# Altium project capstone_pcb.PrjPcb (part 1 of 2)
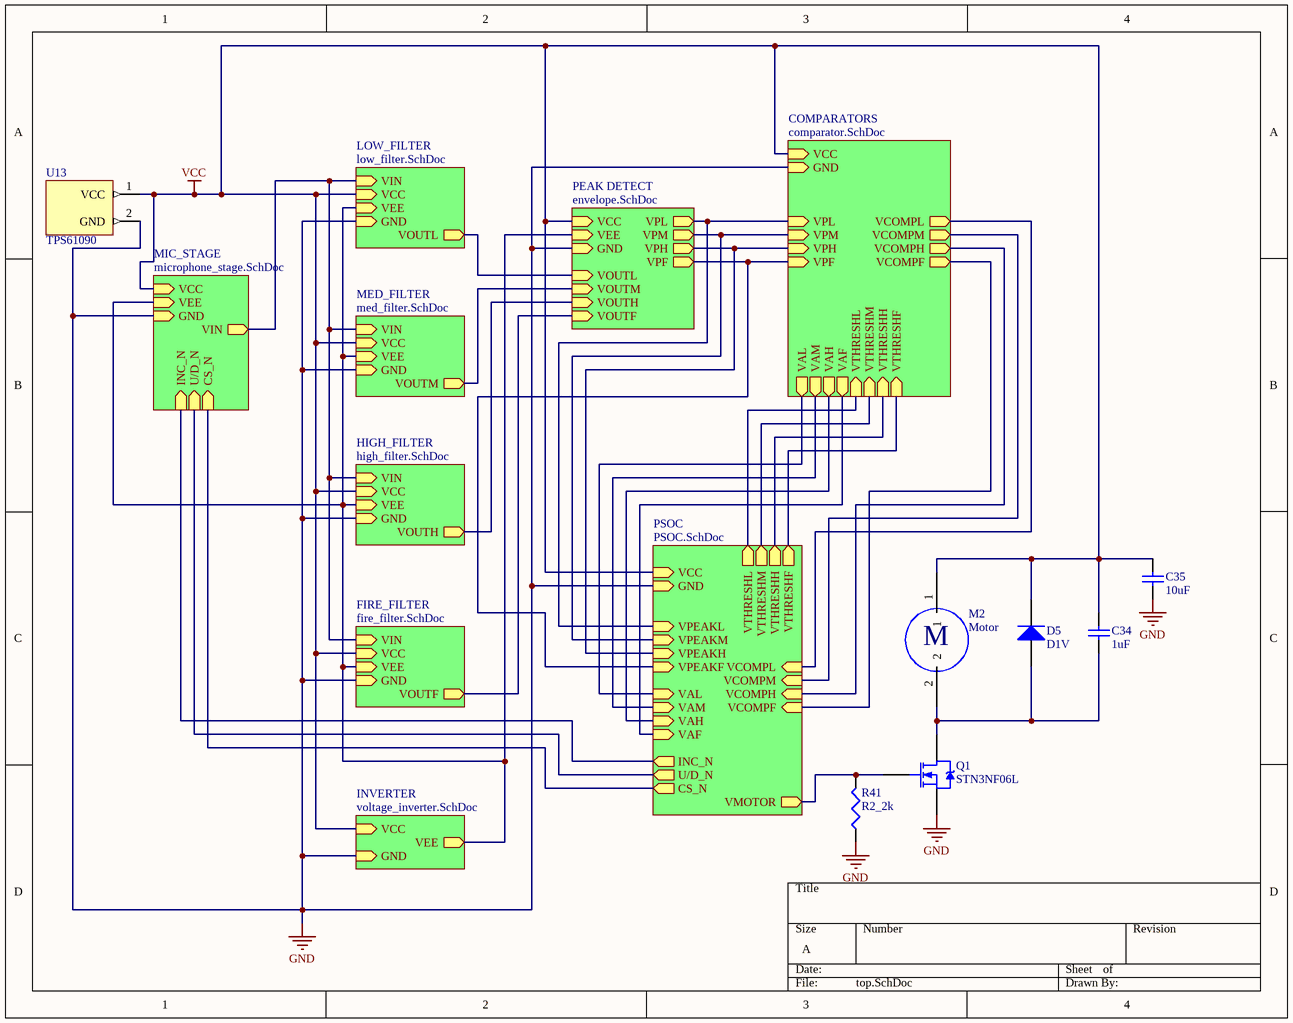
[diagram p0: top.SchDoc]
10 sheets, 108 parts. Net scope: hierarchical (ports join the sheet entries above them; power ports are global).
Board file: top_pcb.PcbDoc
Sheets:
  top.SchDoc
    LOW_FILTER = low_filter.SchDoc
    MED_FILTER = med_filter.SchDoc
    HIGH_FILTER = high_filter.SchDoc
    FIRE_FILTER = fire_filter.SchDoc
    INVERTER = voltage_inverter.SchDoc
    COMPARATORS = comparator.SchDoc
    MIC_STAGE = microphone_stage.SchDoc
    PEAK DETECT = envelope.SchDoc
    PSOC = PSOC.SchDoc

## Sheet top.SchDoc
size A

### Parts
C34  1uF  [C0603]
C35  10uF  [C0603]
D5  D1V  [D1206]
M2  Motor  [B2B-PH-K-S]
Q1  STN3NF06L  [SOT-223]
R41  R2_2k  [R0603]
U13  TPS61090  [B2B-PH-K-S]

### Sub-sheets
COMPARATORS = comparator.SchDoc: VCC (in), VTHRESHL (in), VTHRESHM (in), VTHRESHH (in), GND (in), VTHRESHF (in), VAL (out), VAM (out), VAH (out), VAF (out), VPL (in), VPM (in), VPH (in), VPF (in), VCOMPL (out), VCOMPM (out), VCOMPH (out), VCOMPF (out)
FIRE_FILTER = fire_filter.SchDoc: GND (in), VEE (in), VIN (in), VCC (in), VOUTF (out)
HIGH_FILTER = high_filter.SchDoc: GND (in), VEE (in), VIN (in), VCC (in), VOUTH (out)
INVERTER = voltage_inverter.SchDoc: VCC (in), VEE (out), GND (in)
LOW_FILTER = low_filter.SchDoc: VIN (in), VCC (in), VOUTL (out), VEE (in), GND (in)
MED_FILTER = med_filter.SchDoc: GND (in), VCC (in), VEE (in), VIN (in), VOUTM (out)
MIC_STAGE = microphone_stage.SchDoc: VIN (out), VCC (in), GND (in), VEE (in), U/D_N (in), INC_N (in), CS_N (in)
PEAK DETECT = envelope.SchDoc: VCC (in), VPL (out), VPH (out), VPM (out), VPF (out), GND (in), VEE (in), VOUTL (in), VOUTM (in), VOUTF (in), VOUTH (in)
PSOC = PSOC.SchDoc: VCC (in), VTHRESHL (out), VTHRESHM (out), VTHRESHH (out), VTHRESHF (out), VAL (in), VAM (in), VAH (in), VAF (in), VMOTOR (out), GND (in), VCOMPL (in), VCOMPM (in), VCOMPH (in), VCOMPF (in), INC_N (out), U/D_N (out), CS_N (out), VPEAKL (in), VPEAKM (in), VPEAKH (in), VPEAKF (in)

### Nets
GND: C35.1 Q1.3(S) R41.1 U13.2(GND) ; sheet LOW_FILTER/GND, sheet MED_FILTER/GND, sheet HIGH_FILTER/GND, sheet FIRE_FILTER/GND, sheet INVERTER/GND, sheet COMPARATORS/GND, sheet MIC_STAGE/GND, sheet PEAK DETECT/GND, sheet PSOC/GND
VCC: C34.2 C35.2 D5.2(K) M2.1 U13.1(VCC) ; sheet LOW_FILTER/VCC, sheet MED_FILTER/VCC, sheet HIGH_FILTER/VCC, sheet FIRE_FILTER/VCC, sheet INVERTER/VCC, sheet COMPARATORS/VCC, sheet MIC_STAGE/VCC, sheet PEAK DETECT/VCC, sheet PSOC/VCC
NetC3_1: sheet LOW_FILTER/VOUTL, sheet PEAK DETECT/VOUTL
NetC7_1: sheet MED_FILTER/VOUTM, sheet PEAK DETECT/VOUTM
NetC11_1: sheet HIGH_FILTER/VOUTH, sheet PEAK DETECT/VOUTH
NetC15_1: sheet FIRE_FILTER/VOUTF, sheet PEAK DETECT/VOUTF
NetC18_1: sheet LOW_FILTER/VEE, sheet MED_FILTER/VEE, sheet HIGH_FILTER/VEE, sheet FIRE_FILTER/VEE, sheet INVERTER/VEE, sheet MIC_STAGE/VEE, sheet PEAK DETECT/VEE
NetC19_1: sheet COMPARATORS/VAL, sheet PSOC/VAL
NetC20_2: sheet COMPARATORS/VCOMPL, sheet PSOC/VCOMPL
NetC21_1: sheet COMPARATORS/VAM, sheet PSOC/VAM
NetC22_2: sheet COMPARATORS/VCOMPM, sheet PSOC/VCOMPM
NetC23_1: sheet COMPARATORS/VAH, sheet PSOC/VAH
NetC24_2: sheet COMPARATORS/VCOMPH, sheet PSOC/VCOMPH
NetC26_2: sheet COMPARATORS/VCOMPF, sheet PSOC/VCOMPF
NetC27_1: sheet COMPARATORS/VPL, sheet PEAK DETECT/VPL, sheet PSOC/VPEAKL
NetC28_1: sheet COMPARATORS/VPM, sheet PEAK DETECT/VPM, sheet PSOC/VPEAKM
NetC29_1: sheet COMPARATORS/VPH, sheet PEAK DETECT/VPH, sheet PSOC/VPEAKH
NetC30_1: sheet COMPARATORS/VPF, sheet PEAK DETECT/VPF, sheet PSOC/VPEAKF
NetC34_1: C34.1 D5.1(A) M2.2 Q1.2(D)
NetQ1_1: Q1.1(G) R41.2 ; sheet PSOC/VMOTOR
NetR1_1: sheet LOW_FILTER/VIN, sheet MED_FILTER/VIN, sheet HIGH_FILTER/VIN, sheet FIRE_FILTER/VIN, sheet MIC_STAGE/VIN
NetR25_2: sheet COMPARATORS/VTHRESHL, sheet PSOC/VTHRESHL
NetR27_2: sheet COMPARATORS/VTHRESHM, sheet PSOC/VTHRESHM
NetR29_2: sheet COMPARATORS/VTHRESHH, sheet PSOC/VTHRESHH
NetR31_2: sheet COMPARATORS/VTHRESHF, sheet COMPARATORS/VAF, sheet PSOC/VTHRESHF, sheet PSOC/VAF
NetR43_1: sheet MIC_STAGE/INC_N, sheet PSOC/INC_N
NetR43_2: sheet MIC_STAGE/U/D_N, sheet PSOC/U/D_N
NetR43_7: sheet MIC_STAGE/CS_N, sheet PSOC/CS_N

### Notes on the sheet
- (in symbol Motor) M

### Library data of the parts
C34 = C1uF: 1 uF Surface Mount Capacitor; Manufacturer: Murata Electronics North America; Manufacturer Part Number: GRM188R61C105KA93D; Capacitance: 1µF; Tolerance: ±10%; Voltage - Rated: 16V; Temperature Coefficient: X5R; Supplier 1: Digi-Key; RoHS: RoHS Compliant; Category: Capacitors; Stock 1: 1349645; Pricing 1: 1=0.1, 10=0.034, 50=0.0182, 100=0.0154, 250=0.0126, 500=0.01078, 1000=0.0084 (USD); Packaging: Digi-Reel®; Part Status: Active; Operating Temperature: -55°C ~ 85°C; Features: -; Ratings: -; Applications: General Purpose; Mounting Type: Surface Mount, MLCC; Package / Case: 0603 (1608 Metric); Size / Dimension: 0.063" L x 0.031" W (1.60mm x 0.80mm); Height - Seated (Max): -; Thickness (Max): 0.035" (0.90mm); Lead Spacing: -; Lead Style: -; ComponentLink1URL: http://www.murata.com/~/media/webrenewal/support/library/catalog/products/capacitor/mlcc/c02e.pdf; ComponentLink1Description: http://www.murata.com/~/media/webrenewal/support/library/catalog/products/capacitor/mlcc/c02e.pdf; Supplier Part Number 1: 490-1536-6-ND
C35 = C10uF: 10 uF Surface Mount Capacitor; Manufacturer: Yageo; Manufacturer Part Number: CC0603KRX5R5BB106; Capacitance: 10µF; Tolerance: ±10%; Voltage - Rated: 6.3V; Temperature Coefficient: X5R; Supplier 1: Digi-Key; RoHS: RoHS Compliant; Category: Capacitors; Stock 1: 18386; Pricing 1: 1=0.27, 10=0.186, 25=0.1488, 50=0.124, 100=0.1054, 250=0.08368, 500=0.0744, 1000=0.06509 (USD); Packaging: Digi-Reel®; Part Status: Active; Operating Temperature: -55°C ~ 85°C; Features: -; Ratings: -; Applications: General Purpose; Failure Rate: -; Mounting Type: Surface Mount, MLCC; Package / Case: 0603 (1608 Metric); Size / Dimension: 0.063" L x 0.031" W (1.60mm x 0.80mm); Height - Seated (Max): -; Thickness (Max): 0.035" (0.90mm); Lead Spacing: -; Lead Style: -; ComponentLink1URL: http://www.yageo.com/documents/recent/UPY-GPHC_X5R_4V-to-50V_23.pdf; ComponentLink1Description: http://www.yageo.com/documents/recent/UPY-GPHC_X5R_4V-to-50V_23.pdf; Supplier Part Number 1: 311-1781-6-ND
D5 = D1V: Standard 1V Diode; Manufacturer: Bourns Inc.; Manufacturer Part Number: CD1206-S01575; Voltage - DC Reverse (Vr) (Max): 100V; Current - Average Rectified (Io): 150mA; Voltage - Forward (Vf) (Max) @ If: 1V @ 50mA; Speed: Small Signal =< 200mA (Io), Any Speed; Reverse Recovery Time (trr): 4ns; Current - Reverse Leakage @ Vr: 2.5µA @ 100V; Capacitance @ Vr, F: 3pF @ 0V, 100MHz; Supplier 1: Digi-Key; RoHS: RoHS Compliant; Category: Discrete Semiconductor Products; Stock 1: 122779; Pricing 1: 1=0.15, 10=0.142, 25=0.1288, 100=0.0927, 250=0.0546, 500=0.04532, 1000=0.0309, 2500=0.02626 (USD); Packaging: Cut Tape (CT); Part Status: Active; Diode Type: Standard; Mounting Type: Surface Mount; Package / Case: 1206 (3216 Metric); Supplier Device Package: 1206; Operating Temperature - Junction: -55°C ~ 125°C; ComponentLink1URL: http://www.bourns.com/docs/Product-Datasheets/CD1206_S01575.pdf; ComponentLink1Description: http://www.bourns.com/docs/Product-Datasheets/CD1206_S01575.pdf; Supplier Part Number 1: CD1206-S01575CT-ND
M2 = Motor: Manufacturer: JST Sales America Inc.; Manufacturer Part Number: B2B-PH-K-S(LF)(SN); Connector Type: Header, Shrouded; Number of Positions: 2; Number of Positions Loaded: All; Pitch: 0.079" (2.00mm); Supplier 1: Digi-Key; RoHS: RoHS Compliant; Category: Connectors, Interconnects; Stock 1: 349866; Pricing 1: 1=0.17, 10=0.162, 100=0.1002, 500=0.08288, 1000=0.07252, 5000=0.06216, 10000=0.06044 (USD); Packaging: Bulk; Part Status: Active; Contact Type: Male Pin; Number of Rows: 1; Row Spacing: -; Contact Mating Length: 0.130" (3.30mm); Mounting Type: Through Hole; Termination: Press-Fit, Solder; Fastening Type: Detent Lock; Features: -; Contact Finish: Tin; Contact Finish Thickness: -; Color: Natural; ComponentLink1URL: http://www.jst-mfg.com/product/pdf/eng/ePH.pdf; ComponentLink1Description: http://www.jst-mfg.com/product/pdf/eng/ePH.pdf; Supplier Part Number 1: 455-1704-ND
Q1 = STN3NF06L: N-Channel 4A Power MOSFET; Manufacturer: STMicroelectronics; Drain to Source Voltage (Vdss): 60V; Current - Continuous Drain (Id) @ 25°C: 4A (Tc); Drive Voltage (Max Rds On,  Min Rds On): 5V, 10V; Vgs(th) (Max) @ Id: 2.8V @ 250µA; Gate Charge (Qg) (Max) @ Vgs: 9nC @ 5V; Input Capacitance (Ciss) (Max) @ Vds: 340pF @ 25V; Vgs (Max): ±16V; Power Dissipation (Max): 3.3W (Tc); Rds On (Max) @ Id, Vgs: 100 mOhm @ 1.5A, 10V; Supplier 1: Digi-Key; Manufacturer Part Number: STN3NF06L; RoHS: RoHS Compliant; Category: Discrete Semiconductor Products; Stock 1: 8902; Pricing 1: 1=0.63, 10=0.541, 100=0.4038, 500=0.31724, 1000=0.24514 (USD); Packaging: Digi-Reel®; Part Status: Active; FET Type: N-Channel; Technology: MOSFET (Metal Oxide); FET Feature: -; Operating Temperature: -55°C ~ 150°C (TJ); Mounting Type: Surface Mount; Supplier Device Package: SOT-223; Package / Case: TO-261-4, TO-261AA; ComponentLink1URL: http://www.st.com/content/ccc/resource/technical/document/datasheet/b1/52/93/f0/a9/a9/40/d7/CD00002430.pdf/files/CD00002430.pdf/jcr:content/translations/en.CD00002430.pdf; ComponentLink1Description: http://www.st.com/content/ccc/resource/technical/document/datasheet/b1/52/93/f0/a9/a9/40/d7/CD00002430.pdf/files/CD00002430.pdf/jcr:content/translations/en.CD00002430.pdf; Supplier Part Number 1: 497-3177-6-ND
R41 = R2_2k: 2.2k Ohms Surface Mount Resistor; Manufacturer: Yageo; Manufacturer Part Number: RC0603FR-072K2L; Tolerance: ±1%; Power (Watts): 0.1W, 1/10W; Temperature Coefficient: ±100ppm/°C; Supplier 1: Digi-Key; RoHS: RoHS Compliant; Category: Resistors; Stock 1: 4524664; Pricing 1: 1=0.1, 10=0.013, 25=0.0092, 50=0.007, 100=0.0052, 250=0.00396, 500=0.00316, 1000=0.00233 (USD); Packaging: Digi-Reel®; Part Status: Active; Resistance (Ohms): 2.2k; Composition: Thick Film; Features: Moisture Resistant; Operating Temperature: -55°C ~ 155°C; Package / Case: 0603 (1608 Metric); Supplier Device Package: 0603; Size / Dimension: 0.063" L x 0.031" W (1.60mm x 0.80mm); Height - Seated (Max): 0.022" (0.55mm); Number of Terminations: 2; Failure Rate: -; ComponentLink1URL: http://www.yageo.com/NewPortal/yageodocoutput?fileName=/pdf/R-Chip/PYu-RC_Group_51_RoHS_L_4.pdf; ComponentLink1Description: http://www.yageo.com/NewPortal/yageodocoutput?fileName=/pdf/R-Chip/PYu-RC_Group_51_RoHS_L_4.pdf; Supplier Part Number 1: 311-2.20KHRDKR-ND
U13 = TPS61090: Power Electronics Connector; Manufacturer: JST Sales America Inc.; Manufacturer Part Number: B2B-PH-K-S(LF)(SN); Connector Type: Header; Pitch - Mating: 0.079" (2.00mm); Shrouding: Shrouded - 4 Wall; Number of Positions: 2; Number of Positions Loaded: All; Contact Length - Mating: 0.130" (3.30mm); Supplier 1: Digi-Key; RoHS: RoHS Compliant; Category: Connectors, Interconnects; Stock 1: 327416; Pricing 1: 1=0.17, 10=0.162, 100=0.1002, 500=0.08288, 1000=0.07252, 5000=0.06216, 10000=0.06044 (USD); Packaging: Bulk; Part Status: Active; Contact Type: Male Pin; Number of Rows: 1; Row Spacing - Mating: -; Mounting Type: Through Hole; Termination: Press-Fit, Solder; Fastening Type: Detent Lock; Features: -; Contact Finish - Mating: Tin; Contact Finish Thickness - Mating: -; Insulation Color: Natural; Ingress Protection: -; ComponentLink1URL: http://www.jst-mfg.com/product/pdf/eng/ePH.pdf; ComponentLink1Description: http://www.jst-mfg.com/product/pdf/eng/ePH.pdf; Supplier Part Number 1: 455-1704-ND

## Sheet low_filter.SchDoc
size A
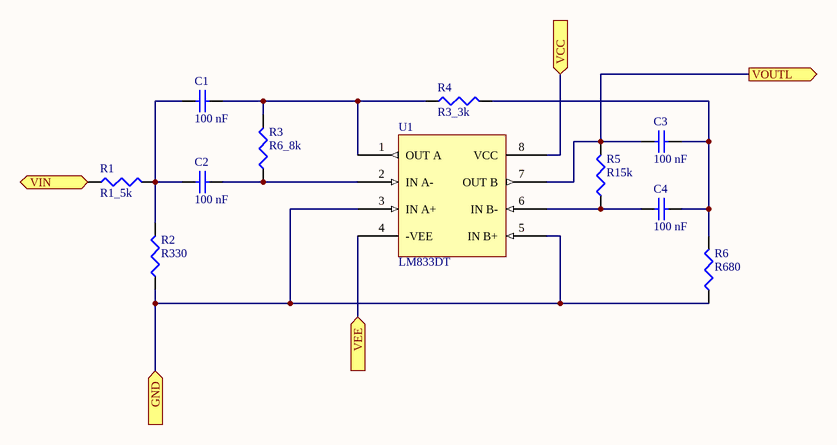
[diagram p1: low_filter.SchDoc]

### Parts
C1  100 nF  [C0603]
C2  100 nF  [C0603]
C3  100 nF  [C0603]
C4  100 nF  [C0603]
R1  R1_5k  [R0603]
R2  R330  [R0603]
R3  R6_8k  [R0603]
R4  R3_3k  [R0603]
R5  R15k  [R0603]
R6  R680  [R0603]
U1  LM833DT  [soic8]

### Ports
GND (in), VCC (in), VEE (in), VIN (in), VOUTL (out)

### Nets
GND: R2.1 R6.1 U1.3(IN_A+) U1.5(IN_B+) ; port GND
VCC: U1.8(VCC) ; port VCC
NetC1_1: C1.1 C2.1 R1.2 R2.2
NetC1_2: C1.2 R3.2 R4.1 U1.1(OUT_A)
NetC2_2: C2.2 R3.1 U1.2(IN_A-)
NetC3_1: C3.1 R5.2 U1.7(OUT_B) ; port VOUTL
NetC3_2: C3.2 C4.2 R4.2 R6.2
NetC4_1: C4.1 R5.1 U1.6(IN_B-)
NetC18_1: U1.4(-VEE) ; port VEE
NetR1_1: R1.1 ; port VIN

### Library data of the parts
C1-C4 = C100nF: 100 nF Surface Mount Capacitor; Manufacturer: Murata Electronics North America; Manufacturer Part Number: GRM188R71C104KA01D; Capacitance: 0.10µF; Tolerance: ±10%; Voltage - Rated: 16V; Temperature Coefficient: X7R; Supplier 1: Digi-Key; RoHS: RoHS Compliant; Category: Capacitors; Stock 1: 4165009; Pricing 1: 1=0.1, 10=0.019, 50=0.0102, 100=0.0086, 250=0.00704, 500=0.006, 1000=0.00468 (USD); Packaging: Digi-Reel®; Part Status: Active; Operating Temperature: -55°C ~ 125°C; Features: -; Ratings: -; Applications: General Purpose; Mounting Type: Surface Mount, MLCC; Package / Case: 0603 (1608 Metric); Size / Dimension: 0.063" L x 0.031" W (1.60mm x 0.80mm); Height - Seated (Max): -; Thickness (Max): 0.035" (0.90mm); Lead Spacing: -; Lead Style: -; ComponentLink1URL: http://www.murata.com/~/media/webrenewal/support/library/catalog/products/capacitor/mlcc/c02e.pdf; ComponentLink1Description: http://www.murata.com/~/media/webrenewal/support/library/catalog/products/capacitor/mlcc/c02e.pdf; Supplier Part Number 1: 490-1532-6-ND
R1 = R1_5k: 1.5k Ohms Surface Mount Resistor; Manufacturer: Yageo; Manufacturer Part Number: RC0603FR-071K5L; Tolerance: ±1%; Power (Watts): 0.1W, 1/10W; Temperature Coefficient: ±100ppm/°C; Supplier 1: Digi-Key; RoHS: RoHS Compliant; Category: Resistors; Stock 1: 1526580; Pricing 1: 1=0.1, 10=0.013, 25=0.0092, 50=0.007, 100=0.0052, 250=0.00396, 500=0.00316, 1000=0.00233 (USD); Packaging: Digi-Reel®; Part Status: Active; Resistance (Ohms): 1.5k; Composition: Thick Film; Features: Moisture Resistant; Operating Temperature: -55°C ~ 155°C; Package / Case: 0603 (1608 Metric); Supplier Device Package: 0603; Size / Dimension: 0.063" L x 0.031" W (1.60mm x 0.80mm); Height - Seated (Max): 0.022" (0.55mm); Number of Terminations: 2; Failure Rate: -; ComponentLink1URL: http://www.yageo.com/NewPortal/yageodocoutput?fileName=/pdf/R-Chip/PYu-RC_Group_51_RoHS_L_4.pdf; ComponentLink1Description: http://www.yageo.com/NewPortal/yageodocoutput?fileName=/pdf/R-Chip/PYu-RC_Group_51_RoHS_L_4.pdf; Supplier Part Number 1: 311-1.50KHRDKR-ND
R2 = R330: 330 Ohms Surface Mount Resistor; Manufacturer: Yageo; Manufacturer Part Number: RC0603FR-07330RL; Resistance (Ohms): 330; Tolerance: ±1%; Power (Watts): 0.1W, 1/10W; Temperature Coefficient: ±100ppm/°C; Supplier 1: Digi-Key; RoHS: RoHS Compliant; Category: Resistors; Stock 1: 2252499; Pricing 1: 1=0.1, 10=0.013, 25=0.0092, 50=0.007, 100=0.0052, 250=0.00396, 500=0.00316, 1000=0.00233 (USD); Packaging: Digi-Reel®; Part Status: Active; Composition: Thick Film; Features: Moisture Resistant; Operating Temperature: -55°C ~ 155°C; Package / Case: 0603 (1608 Metric); Supplier Device Package: 0603; Size / Dimension: 0.063" L x 0.031" W (1.60mm x 0.80mm); Height - Seated (Max): 0.022" (0.55mm); Number of Terminations: 2; Failure Rate: -; ComponentLink1URL: http://www.yageo.com/NewPortal/yageodocoutput?fileName=/pdf/R-Chip/PYu-RC_Group_51_RoHS_L_4.pdf; ComponentLink1Description: http://www.yageo.com/NewPortal/yageodocoutput?fileName=/pdf/R-Chip/PYu-RC_Group_51_RoHS_L_4.pdf; Supplier Part Number 1: 311-330HRDKR-ND
R3 = R6_8k: 6.8k Ohms Surface Mount Resistor; Manufacturer: Panasonic Electronic Components; Manufacturer Part Number: ERJ-3EKF6801V; Tolerance: ±1%; Power (Watts): 0.1W, 1/10W; Temperature Coefficient: ±100ppm/°C; Supplier 1: Digi-Key; RoHS: RoHS Compliant; Category: Resistors; Stock 1: 100612; Pricing 1: 1=0.1, 10=0.019, 25=0.0136, 50=0.0104, 100=0.0077, 250=0.00584, 500=0.00468, 1000=0.00345 (USD); Packaging: Cut Tape (CT); Part Status: Active; Resistance (Ohms): 6.8k; Composition: Thick Film; Features: Automotive AEC-Q200; Operating Temperature: -55°C ~ 155°C; Package / Case: 0603 (1608 Metric); Supplier Device Package: 0603; Size / Dimension: 0.063" L x 0.031" W (1.60mm x 0.80mm); Height - Seated (Max): 0.022" (0.55mm); Number of Terminations: 2; Failure Rate: -; ComponentLink1URL: https://industrial.panasonic.com/cdbs/www-data/pdf/RDA0000/AOA0000C283.pdf; ComponentLink1Description: https://industrial.panasonic.com/cdbs/www-data/pdf/RDA0000/AOA0000C283.pdf; Supplier Part Number 1: P6.80KHCT-ND
R4 = R3_3k: 3.3k Ohms Surface Mount Resistor; Manufacturer: Yageo; Manufacturer Part Number: RC0603FR-073K3L; Tolerance: ±1%; Power (Watts): 0.1W, 1/10W; Temperature Coefficient: ±100ppm/°C; Supplier 1: Digi-Key; RoHS: RoHS Compliant; Category: Resistors; Stock 1: 1695943; Pricing 1: 1=0.1, 10=0.013, 25=0.0092, 50=0.007, 100=0.0052, 250=0.00396, 500=0.00316, 1000=0.00233 (USD); Packaging: Digi-Reel®; Part Status: Active; Resistance (Ohms): 3.3k; Composition: Thick Film; Features: Moisture Resistant; Operating Temperature: -55°C ~ 155°C; Package / Case: 0603 (1608 Metric); Supplier Device Package: 0603; Size / Dimension: 0.063" L x 0.031" W (1.60mm x 0.80mm); Height - Seated (Max): 0.022" (0.55mm); Number of Terminations: 2; Failure Rate: -; ComponentLink1URL: http://www.yageo.com/NewPortal/yageodocoutput?fileName=/pdf/R-Chip/PYu-RC_Group_51_RoHS_L_4.pdf; ComponentLink1Description: http://www.yageo.com/NewPortal/yageodocoutput?fileName=/pdf/R-Chip/PYu-RC_Group_51_RoHS_L_4.pdf; Supplier Part Number 1: 311-3.30KHRDKR-ND
R5 = R15k: 15k Ohms Surface Mount Resistor; Manufacturer: Yageo; Manufacturer Part Number: RC0603FR-0715KL; Tolerance: ±1%; Power (Watts): 0.1W, 1/10W; Temperature Coefficient: ±100ppm/°C; Supplier 1: Digi-Key; RoHS: RoHS Compliant; Category: Resistors; Stock 1: 489455; Pricing 1: 1=0.1, 10=0.013, 25=0.0092, 50=0.007, 100=0.0052, 250=0.00396, 500=0.00316, 1000=0.00233 (USD); Packaging: Digi-Reel®; Part Status: Active; Resistance (Ohms): 15k; Composition: Thick Film; Features: Moisture Resistant; Operating Temperature: -55°C ~ 155°C; Package / Case: 0603 (1608 Metric); Supplier Device Package: 0603; Size / Dimension: 0.063" L x 0.031" W (1.60mm x 0.80mm); Height - Seated (Max): 0.022" (0.55mm); Number of Terminations: 2; Failure Rate: -; ComponentLink1URL: http://www.yageo.com/NewPortal/yageodocoutput?fileName=/pdf/R-Chip/PYu-RC_Group_51_RoHS_L_4.pdf; ComponentLink1Description: http://www.yageo.com/NewPortal/yageodocoutput?fileName=/pdf/R-Chip/PYu-RC_Group_51_RoHS_L_4.pdf; Supplier Part Number 1: 311-15.0KHRDKR-ND
R6 = R680: 680 Ohms Surface Mount Resistor; Manufacturer: Yageo; Manufacturer Part Number: RC0603FR-07680RL; Resistance (Ohms): 680; Tolerance: ±1%; Power (Watts): 0.1W, 1/10W; Temperature Coefficient: ±100ppm/°C; Supplier 1: Digi-Key; RoHS: RoHS Compliant; Category: Resistors; Stock 1: 1276811; Pricing 1: 1=0.1, 10=0.013, 25=0.0092, 50=0.007, 100=0.0052, 250=0.00396, 500=0.00316, 1000=0.00233 (USD); Packaging: Digi-Reel®; Part Status: Active; Composition: Thick Film; Features: Moisture Resistant; Operating Temperature: -55°C ~ 155°C; Package / Case: 0603 (1608 Metric); Supplier Device Package: 0603; Size / Dimension: 0.063" L x 0.031" W (1.60mm x 0.80mm); Height - Seated (Max): 0.022" (0.55mm); Number of Terminations: 2; Failure Rate: -; ComponentLink1URL: http://www.yageo.com/NewPortal/yageodocoutput?fileName=/pdf/R-Chip/PYu-RC_Group_51_RoHS_L_4.pdf; ComponentLink1Description: http://www.yageo.com/NewPortal/yageodocoutput?fileName=/pdf/R-Chip/PYu-RC_Group_51_RoHS_L_4.pdf; Supplier Part Number 1: 311-680HRDKR-ND
U1 = LM833DT: IC Dual Audio Amplifier; Manufacturer: STMicroelectronics; Number of Circuits: 2; Slew Rate: 7 V/µs; Gain Bandwidth Product: 15MHz; Current - Input Bias: 300nA; Voltage - Input Offset: 300µV; Current - Supply: 4mA; Voltage - Supply, Single/Dual (±): 5 V ~ 30 V, ±2.5 V ~ 15 V; Supplier 1: Digi-Key; Manufacturer Part Number: LM833DT; RoHS: RoHS Compliant; Category: Integrated Circuits (ICs); Stock 1: 35363; Pricing 1: 1=0.45, 10=0.382, 100=0.2855, 500=0.22434, 1000=0.17335 (USD); Packaging: Cut Tape (CT); Part Status: Active; Amplifier Type: Audio; Output Type: -; -3db Bandwidth: -; Current - Output / Channel: -; Operating Temperature: -40°C ~ 105°C; Mounting Type: Surface Mount; Package / Case: 8-SOIC (0.154", 3.90mm Width); Supplier Device Package: 8-SO; ComponentLink1URL: http://www.st.com/content/ccc/resource/technical/document/datasheet/3b/52/12/a5/70/7c/44/0a/CD00000470.pdf/files/CD00000470.pdf/jcr:content/translations/en.CD00000470.pdf; ComponentLink1Description: http://www.st.com/content/ccc/resource/technical/document/datasheet/3b/52/12/a5/70/7c/44/0a/CD00000470.pdf/files/CD00000470.pdf/jcr:content/translations/en.CD00000470.pdf; Supplier Part Number 1: 497-1597-1-ND

## Sheet med_filter.SchDoc
size A
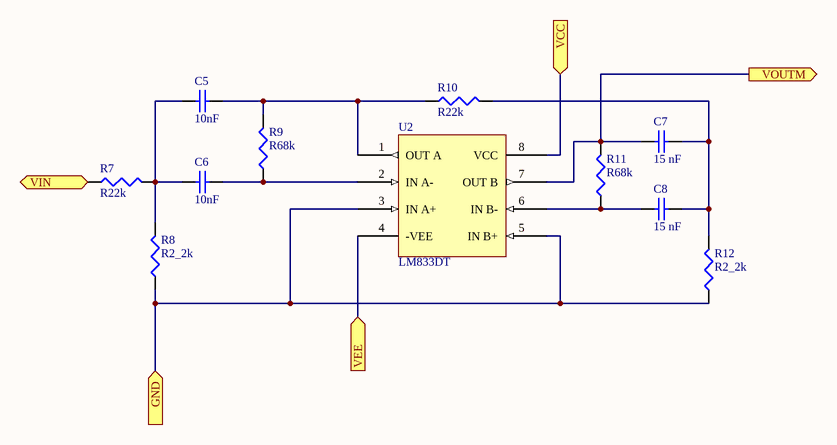
[diagram p2: med_filter.SchDoc]

### Parts
C5  10nF  [C0603]
C6  10nF  [C0603]
C7  15 nF  [C0603]
C8  15 nF  [C0603]
R7  R22k  [R0603]
R8  R2_2k  [R0603]
R9  R68k  [R0603]
R10  R22k  [R0603]
R11  R68k  [R0603]
R12  R2_2k  [R0603]
U2  LM833DT  [soic8]

### Ports
GND (in), VCC (in), VEE (in), VIN (in), VOUTM (out)

### Nets
GND: R8.1 R12.1 U2.3(IN_A+) U2.5(IN_B+) ; port GND
VCC: U2.8(VCC) ; port VCC
NetC5_1: C5.1 C6.1 R7.2 R8.2
NetC5_2: C5.2 R9.2 R10.1 U2.1(OUT_A)
NetC6_2: C6.2 R9.1 U2.2(IN_A-)
NetC7_1: C7.1 R11.2 U2.7(OUT_B) ; port VOUTM
NetC7_2: C7.2 C8.2 R10.2 R12.2
NetC8_1: C8.1 R11.1 U2.6(IN_B-)
NetC18_1: U2.4(-VEE) ; port VEE
NetR1_1: R7.1 ; port VIN

### Library data of the parts
C5 C6 = C10nF: 10 nF Surface Mount Capacitor; Manufacturer: Murata Electronics North America; Manufacturer Part Number: GRM188R70J103KA01D; Capacitance: 10000pF; Tolerance: ±10%; Voltage - Rated: 6.3V; Temperature Coefficient: X7R; Supplier 1: Digi-Key; RoHS: RoHS Compliant; Category: Capacitors; Stock 1: 37902; Pricing 1: 1=0.1, 10=0.049, 50=0.0266, 100=0.0226, 250=0.01844, 500=0.01578, 1000=0.0123 (USD); Packaging: Digi-Reel®; Part Status: Active; Operating Temperature: -55°C ~ 125°C; Features: -; Ratings: -; Applications: General Purpose; Mounting Type: Surface Mount, MLCC; Package / Case: 0603 (1608 Metric); Size / Dimension: 0.063" L x 0.031" W (1.60mm x 0.80mm); Height - Seated (Max): -; Thickness (Max): 0.035" (0.90mm); Lead Spacing: -; Lead Style: -; ComponentLink1URL: http://www.murata.com/~/media/webrenewal/support/library/catalog/products/capacitor/mlcc/c02e.pdf; ComponentLink1Description: http://www.murata.com/~/media/webrenewal/support/library/catalog/products/capacitor/mlcc/c02e.pdf; Supplier Part Number 1: 490-9729-6-ND
C7 C8 = C15nF: 15 nF Surface Mount Capacitor; Manufacturer: Murata Electronics North America; Manufacturer Part Number: GRM188R71H153KA01D; Capacitance: 0.015µF; Tolerance: ±10%; Voltage - Rated: 50V; Temperature Coefficient: X7R; Supplier 1: Digi-Key; RoHS: RoHS Compliant; Category: Capacitors; Stock 1: 98716; Pricing 1: 1=0.1, 10=0.043, 50=0.0234, 100=0.0198, 250=0.0162, 500=0.01386, 1000=0.0108 (USD); Packaging: Digi-Reel®; Part Status: Active; Operating Temperature: -55°C ~ 125°C; Features: -; Ratings: -; Applications: General Purpose; Mounting Type: Surface Mount, MLCC; Package / Case: 0603 (1608 Metric); Size / Dimension: 0.063" L x 0.031" W (1.60mm x 0.80mm); Height - Seated (Max): -; Thickness (Max): 0.035" (0.90mm); Lead Spacing: -; Lead Style: -; ComponentLink1URL: http://www.murata.com/~/media/webrenewal/support/library/catalog/products/capacitor/mlcc/c02e.pdf; ComponentLink1Description: http://www.murata.com/~/media/webrenewal/support/library/catalog/products/capacitor/mlcc/c02e.pdf; Supplier Part Number 1: 490-1514-6-ND
R7 R10 = R22k: 22k Ohms Surface Mount Resistor; Manufacturer: Yageo; Manufacturer Part Number: RC0603FR-0722KL; Tolerance: ±1%; Power (Watts): 0.1W, 1/10W; Temperature Coefficient: ±100ppm/°C; Supplier 1: Digi-Key; RoHS: RoHS Compliant; Category: Resistors; Stock 1: 2279950; Pricing 1: 1=0.1, 10=0.013, 25=0.0092, 50=0.007, 100=0.0052, 250=0.00396, 500=0.00316, 1000=0.00233 (USD); Packaging: Digi-Reel®; Part Status: Active; Resistance (Ohms): 22k; Composition: Thick Film; Features: Moisture Resistant; Operating Temperature: -55°C ~ 155°C; Package / Case: 0603 (1608 Metric); Supplier Device Package: 0603; Size / Dimension: 0.063" L x 0.031" W (1.60mm x 0.80mm); Height - Seated (Max): 0.022" (0.55mm); Number of Terminations: 2; Failure Rate: -; ComponentLink1URL: http://www.yageo.com/NewPortal/yageodocoutput?fileName=/pdf/R-Chip/PYu-RC_Group_51_RoHS_L_4.pdf; ComponentLink1Description: http://www.yageo.com/NewPortal/yageodocoutput?fileName=/pdf/R-Chip/PYu-RC_Group_51_RoHS_L_4.pdf; Supplier Part Number 1: 311-22.0KHRDKR-ND
R8 R12 = R2_2k: as R41 on sheet top; Supplier 1: Digi-Key; RoHS: RoHS Compliant; Category: Resistors; Stock 1: 4524664; Pricing 1: 1=0.1, 10=0.013, 25=0.0092, 50=0.007, 100=0.0052, 250=0.00396, 500=0.00316, 1000=0.00233 (USD); Packaging: Digi-Reel®; Part Status: Active; Resistance (Ohms): 2.2k; Composition: Thick Film; Features: Moisture Resistant; Operating Temperature: -55°C ~ 155°C; Package / Case: 0603 (1608 Metric); Supplier Device Package: 0603; Size / Dimension: 0.063" L x 0.031" W (1.60mm x 0.80mm); Height - Seated (Max): 0.022" (0.55mm); Number of Terminations: 2; Failure Rate: -; ComponentLink1URL: http://www.yageo.com/NewPortal/yageodocoutput?fileName=/pdf/R-Chip/PYu-RC_Group_51_RoHS_L_4.pdf; ComponentLink1Description: http://www.yageo.com/NewPortal/yageodocoutput?fileName=/pdf/R-Chip/PYu-RC_Group_51_RoHS_L_4.pdf; Supplier Part Number 1: 311-2.20KHRDKR-ND
R9 R11 = R68k: 68k Ohms Surface Mount Resistor; Manufacturer: Panasonic Electronic Components; Manufacturer Part Number: ERJ-3EKF6802V; Tolerance: ±1%; Power (Watts): 0.1W, 1/10W; Temperature Coefficient: ±100ppm/°C; Supplier 1: Digi-Key; RoHS: RoHS Compliant; Category: Resistors; Stock 1: 139857; Pricing 1: 1=0.1, 10=0.019, 25=0.0136, 50=0.0104, 100=0.0077, 250=0.00584, 500=0.00468, 1000=0.00345 (USD); Packaging: Cut Tape (CT); Part Status: Active; Resistance (Ohms): 68k; Composition: Thick Film; Features: Automotive AEC-Q200; Operating Temperature: -55°C ~ 155°C; Package / Case: 0603 (1608 Metric); Supplier Device Package: 0603; Size / Dimension: 0.063" L x 0.031" W (1.60mm x 0.80mm); Height - Seated (Max): 0.022" (0.55mm); Number of Terminations: 2; Failure Rate: -; ComponentLink1URL: https://industrial.panasonic.com/cdbs/www-data/pdf/RDA0000/AOA0000C283.pdf; ComponentLink1Description: https://industrial.panasonic.com/cdbs/www-data/pdf/RDA0000/AOA0000C283.pdf; Supplier Part Number 1: P68.0KHCT-ND
U2 = LM833DT: as U1 on sheet low_filter; Supplier 1: Digi-Key; Manufacturer Part Number: LM833DT; RoHS: RoHS Compliant; Category: Integrated Circuits (ICs); Stock 1: 35363; Pricing 1: 1=0.45, 10=0.382, 100=0.2855, 500=0.22434, 1000=0.17335 (USD); Packaging: Cut Tape (CT); Part Status: Active; Amplifier Type: Audio; Output Type: -; -3db Bandwidth: -; Current - Output / Channel: -; Operating Temperature: -40°C ~ 105°C; Mounting Type: Surface Mount; Package / Case: 8-SOIC (0.154", 3.90mm Width); Supplier Device Package: 8-SO; ComponentLink1URL: http://www.st.com/content/ccc/resource/technical/document/datasheet/3b/52/12/a5/70/7c/44/0a/CD00000470.pdf/files/CD00000470.pdf/jcr:content/translations/en.CD00000470.pdf; ComponentLink1Description: http://www.st.com/content/ccc/resource/technical/document/datasheet/3b/52/12/a5/70/7c/44/0a/CD00000470.pdf/files/CD00000470.pdf/jcr:content/translations/en.CD00000470.pdf; Supplier Part Number 1: 497-1597-1-ND

## Sheet high_filter.SchDoc
size A
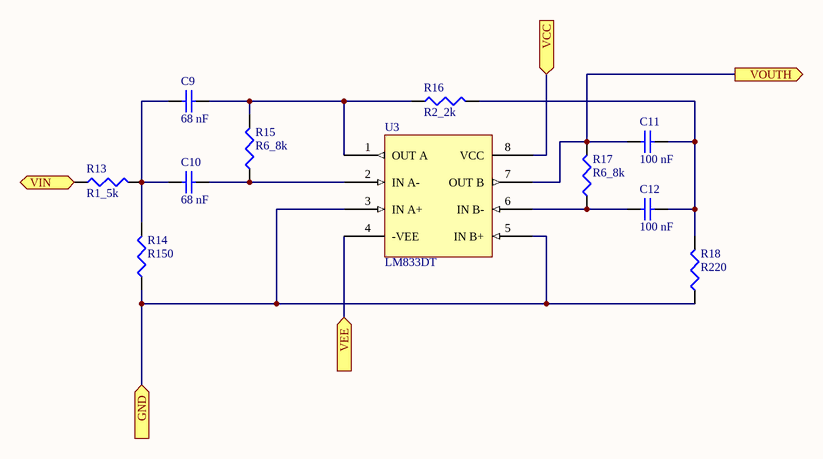
[diagram p3: high_filter.SchDoc]

### Parts
C9  68 nF  [C0603]
C10  68 nF  [C0603]
C11  100 nF  [C0603]
C12  100 nF  [C0603]
R13  R1_5k  [R0603]
R14  R150  [R0603]
R15  R6_8k  [R0603]
R16  R2_2k  [R0603]
R17  R6_8k  [R0603]
R18  R220  [R0603]
U3  LM833DT  [soic8]

### Ports
GND (in), VCC (in), VEE (in), VIN (in), VOUTH (out)

### Nets
GND: R14.1 R18.1 U3.3(IN_A+) U3.5(IN_B+) ; port GND
VCC: U3.8(VCC) ; port VCC
NetC9_1: C9.1 C10.1 R13.2 R14.2
NetC9_2: C9.2 R15.2 R16.1 U3.1(OUT_A)
NetC10_2: C10.2 R15.1 U3.2(IN_A-)
NetC11_1: C11.1 R17.2 U3.7(OUT_B) ; port VOUTH
NetC11_2: C11.2 C12.2 R16.2 R18.2
NetC12_1: C12.1 R17.1 U3.6(IN_B-)
NetC18_1: U3.4(-VEE) ; port VEE
NetR1_1: R13.1 ; port VIN

### Library data of the parts
C9 C10 = C68nF: 68 nF Surface Mount Capacitor; Manufacturer: Murata Electronics North America; Manufacturer Part Number: GRM188R71E683KA01D; Capacitance: 0.068µF; Tolerance: ±10%; Voltage - Rated: 25V; Temperature Coefficient: X7R; Supplier 1: Digi-Key; RoHS: RoHS Compliant; Category: Capacitors; Stock 1: 117781; Pricing 1: 1=0.1, 10=0.056, 50=0.0306, 100=0.0259, 250=0.02116, 500=0.0181, 1000=0.0141 (USD); Packaging: Digi-Reel®; Part Status: Active; Operating Temperature: -55°C ~ 125°C; Features: -; Ratings: -; Applications: General Purpose; Mounting Type: Surface Mount, MLCC; Package / Case: 0603 (1608 Metric); Size / Dimension: 0.063" L x 0.031" W (1.60mm x 0.80mm); Height - Seated (Max): -; Thickness (Max): 0.035" (0.90mm); Lead Spacing: -; Lead Style: -; ComponentLink1URL: http://www.murata.com/~/media/webrenewal/support/library/catalog/products/capacitor/mlcc/c02e.pdf; ComponentLink1Description: http://www.murata.com/~/media/webrenewal/support/library/catalog/products/capacitor/mlcc/c02e.pdf; Supplier Part Number 1: 490-1523-6-ND
C11 C12 = C100nF: as C1 on sheet low_filter; Supplier 1: Digi-Key; RoHS: RoHS Compliant; Category: Capacitors; Stock 1: 4165009; Pricing 1: 1=0.1, 10=0.019, 50=0.0102, 100=0.0086, 250=0.00704, 500=0.006, 1000=0.00468 (USD); Packaging: Digi-Reel®; Part Status: Active; Operating Temperature: -55°C ~ 125°C; Features: -; Ratings: -; Applications: General Purpose; Mounting Type: Surface Mount, MLCC; Package / Case: 0603 (1608 Metric); Size / Dimension: 0.063" L x 0.031" W (1.60mm x 0.80mm); Height - Seated (Max): -; Thickness (Max): 0.035" (0.90mm); Lead Spacing: -; Lead Style: -; ComponentLink1URL: http://www.murata.com/~/media/webrenewal/support/library/catalog/products/capacitor/mlcc/c02e.pdf; ComponentLink1Description: http://www.murata.com/~/media/webrenewal/support/library/catalog/products/capacitor/mlcc/c02e.pdf; Supplier Part Number 1: 490-1532-6-ND
R13 = R1_5k: as R1 on sheet low_filter; Supplier 1: Digi-Key; RoHS: RoHS Compliant; Category: Resistors; Stock 1: 1526580; Pricing 1: 1=0.1, 10=0.013, 25=0.0092, 50=0.007, 100=0.0052, 250=0.00396, 500=0.00316, 1000=0.00233 (USD); Packaging: Digi-Reel®; Part Status: Active; Resistance (Ohms): 1.5k; Composition: Thick Film; Features: Moisture Resistant; Operating Temperature: -55°C ~ 155°C; Package / Case: 0603 (1608 Metric); Supplier Device Package: 0603; Size / Dimension: 0.063" L x 0.031" W (1.60mm x 0.80mm); Height - Seated (Max): 0.022" (0.55mm); Number of Terminations: 2; Failure Rate: -; ComponentLink1URL: http://www.yageo.com/NewPortal/yageodocoutput?fileName=/pdf/R-Chip/PYu-RC_Group_51_RoHS_L_4.pdf; ComponentLink1Description: http://www.yageo.com/NewPortal/yageodocoutput?fileName=/pdf/R-Chip/PYu-RC_Group_51_RoHS_L_4.pdf; Supplier Part Number 1: 311-1.50KHRDKR-ND
R14 = R150: 150 Ohms Surface Mount Resistor; Manufacturer: Yageo; Manufacturer Part Number: RC0603FR-07150RL; Resistance (Ohms): 150; Tolerance: ±1%; Power (Watts): 0.1W, 1/10W; Temperature Coefficient: ±100ppm/°C; Supplier 1: Digi-Key; RoHS: RoHS Compliant; Category: Resistors; Stock 1: 875380; Pricing 1: 1=0.1, 10=0.013, 25=0.0092, 50=0.007, 100=0.0052, 250=0.00396, 500=0.00316, 1000=0.00233 (USD); Packaging: Digi-Reel®; Part Status: Active; Composition: Thick Film; Features: Moisture Resistant; Operating Temperature: -55°C ~ 155°C; Package / Case: 0603 (1608 Metric); Supplier Device Package: 0603; Size / Dimension: 0.063" L x 0.031" W (1.60mm x 0.80mm); Height - Seated (Max): 0.022" (0.55mm); Number of Terminations: 2; Failure Rate: -; ComponentLink1URL: http://www.yageo.com/NewPortal/yageodocoutput?fileName=/pdf/R-Chip/PYu-RC_Group_51_RoHS_L_4.pdf; ComponentLink1Description: http://www.yageo.com/NewPortal/yageodocoutput?fileName=/pdf/R-Chip/PYu-RC_Group_51_RoHS_L_4.pdf; Supplier Part Number 1: 311-150HRDKR-ND
R15 R17 = R6_8k: as R3 on sheet low_filter; Supplier 1: Digi-Key; RoHS: RoHS Compliant; Category: Resistors; Stock 1: 100612; Pricing 1: 1=0.1, 10=0.019, 25=0.0136, 50=0.0104, 100=0.0077, 250=0.00584, 500=0.00468, 1000=0.00345 (USD); Packaging: Cut Tape (CT); Part Status: Active; Resistance (Ohms): 6.8k; Composition: Thick Film; Features: Automotive AEC-Q200; Operating Temperature: -55°C ~ 155°C; Package / Case: 0603 (1608 Metric); Supplier Device Package: 0603; Size / Dimension: 0.063" L x 0.031" W (1.60mm x 0.80mm); Height - Seated (Max): 0.022" (0.55mm); Number of Terminations: 2; Failure Rate: -; ComponentLink1URL: https://industrial.panasonic.com/cdbs/www-data/pdf/RDA0000/AOA0000C283.pdf; ComponentLink1Description: https://industrial.panasonic.com/cdbs/www-data/pdf/RDA0000/AOA0000C283.pdf; Supplier Part Number 1: P6.80KHCT-ND
R16 = R2_2k: as R41 on sheet top; Supplier 1: Digi-Key; RoHS: RoHS Compliant; Category: Resistors; Stock 1: 4524664; Pricing 1: 1=0.1, 10=0.013, 25=0.0092, 50=0.007, 100=0.0052, 250=0.00396, 500=0.00316, 1000=0.00233 (USD); Packaging: Digi-Reel®; Part Status: Active; Resistance (Ohms): 2.2k; Composition: Thick Film; Features: Moisture Resistant; Operating Temperature: -55°C ~ 155°C; Package / Case: 0603 (1608 Metric); Supplier Device Package: 0603; Size / Dimension: 0.063" L x 0.031" W (1.60mm x 0.80mm); Height - Seated (Max): 0.022" (0.55mm); Number of Terminations: 2; Failure Rate: -; ComponentLink1URL: http://www.yageo.com/NewPortal/yageodocoutput?fileName=/pdf/R-Chip/PYu-RC_Group_51_RoHS_L_4.pdf; ComponentLink1Description: http://www.yageo.com/NewPortal/yageodocoutput?fileName=/pdf/R-Chip/PYu-RC_Group_51_RoHS_L_4.pdf; Supplier Part Number 1: 311-2.20KHRDKR-ND
R18 = R220: 220 Ohms Surface Mount Resistor; Manufacturer: Yageo; Manufacturer Part Number: RC0603FR-07220RL; Resistance (Ohms): 220; Tolerance: ±1%; Power (Watts): 0.1W, 1/10W; Temperature Coefficient: ±100ppm/°C; Supplier 1: Digi-Key; RoHS: RoHS Compliant; Category: Resistors; Stock 1: 692235; Pricing 1: 1=0.1, 10=0.013, 25=0.0092, 50=0.007, 100=0.0052, 250=0.00396, 500=0.00316, 1000=0.00233 (USD); Packaging: Digi-Reel®; Part Status: Active; Composition: Thick Film; Features: Moisture Resistant; Operating Temperature: -55°C ~ 155°C; Package / Case: 0603 (1608 Metric); Supplier Device Package: 0603; Size / Dimension: 0.063" L x 0.031" W (1.60mm x 0.80mm); Height - Seated (Max): 0.022" (0.55mm); Number of Terminations: 2; Failure Rate: -; ComponentLink1URL: http://www.yageo.com/NewPortal/yageodocoutput?fileName=/pdf/R-Chip/PYu-RC_Group_51_RoHS_L_4.pdf; ComponentLink1Description: http://www.yageo.com/NewPortal/yageodocoutput?fileName=/pdf/R-Chip/PYu-RC_Group_51_RoHS_L_4.pdf; Supplier Part Number 1: 311-220HRDKR-ND
U3 = LM833DT: as U1 on sheet low_filter; Supplier 1: Digi-Key; Manufacturer Part Number: LM833DT; RoHS: RoHS Compliant; Category: Integrated Circuits (ICs); Stock 1: 35363; Pricing 1: 1=0.45, 10=0.382, 100=0.2855, 500=0.22434, 1000=0.17335 (USD); Packaging: Cut Tape (CT); Part Status: Active; Amplifier Type: Audio; Output Type: -; -3db Bandwidth: -; Current - Output / Channel: -; Operating Temperature: -40°C ~ 105°C; Mounting Type: Surface Mount; Package / Case: 8-SOIC (0.154", 3.90mm Width); Supplier Device Package: 8-SO; ComponentLink1URL: http://www.st.com/content/ccc/resource/technical/document/datasheet/3b/52/12/a5/70/7c/44/0a/CD00000470.pdf/files/CD00000470.pdf/jcr:content/translations/en.CD00000470.pdf; ComponentLink1Description: http://www.st.com/content/ccc/resource/technical/document/datasheet/3b/52/12/a5/70/7c/44/0a/CD00000470.pdf/files/CD00000470.pdf/jcr:content/translations/en.CD00000470.pdf; Supplier Part Number 1: 497-1597-1-ND

## Sheet fire_filter.SchDoc
size A
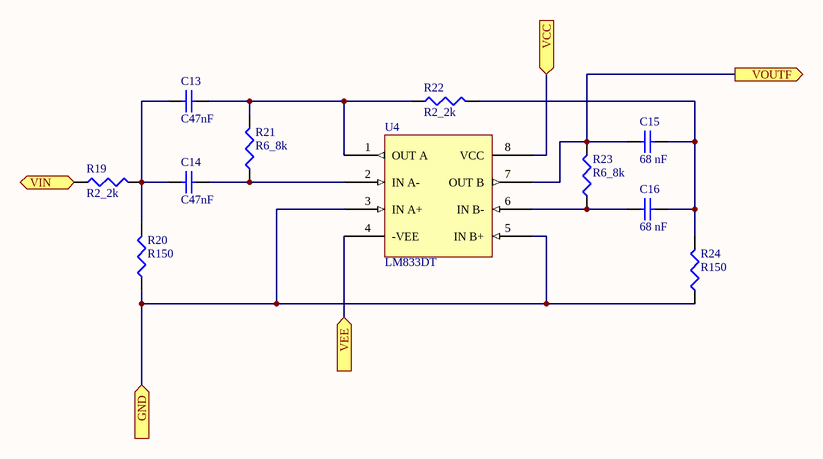
[diagram p4: fire_filter.SchDoc]

### Parts
C13  C47nF  [C0603]
C14  C47nF  [C0603]
C15  68 nF  [C0603]
C16  68 nF  [C0603]
R19  R2_2k  [R0603]
R20  R150  [R0603]
R21  R6_8k  [R0603]
R22  R2_2k  [R0603]
R23  R6_8k  [R0603]
R24  R150  [R0603]
U4  LM833DT  [soic8]

### Ports
GND (in), VCC (in), VEE (in), VIN (in), VOUTF (out)

### Nets
GND: R20.1 R24.1 U4.3(IN_A+) U4.5(IN_B+) ; port GND
VCC: U4.8(VCC) ; port VCC
NetC13_1: C13.1 C14.1 R19.2 R20.2
NetC13_2: C13.2 R21.2 R22.1 U4.1(OUT_A)
NetC14_2: C14.2 R21.1 U4.2(IN_A-)
NetC15_1: C15.1 R23.2 U4.7(OUT_B) ; port VOUTF
NetC15_2: C15.2 C16.2 R22.2 R24.2
NetC16_1: C16.1 R23.1 U4.6(IN_B-)
NetC18_1: U4.4(-VEE) ; port VEE
NetR1_1: R19.1 ; port VIN

### Library data of the parts
C13 C14 = C47nF: 47 nF Surface Mount Capacitor; Manufacturer: Murata Electronics North America; Manufacturer Part Number: GRM188R71C473KA01D; Capacitance: 0.047µF; Tolerance: ±10%; Voltage - Rated: 16V; Temperature Coefficient: X7R; Supplier 1: Digi-Key; RoHS: RoHS Compliant; Category: Capacitors; Stock 1: 56351; Pricing 1: 1=0.1, 10=0.042, 50=0.0226, 100=0.0191, 250=0.01568, 500=0.0134, 1000=0.01044 (USD); Packaging: Digi-Reel®; Part Status: Active; Operating Temperature: -55°C ~ 125°C; Features: -; Ratings: -; Applications: General Purpose; Mounting Type: Surface Mount, MLCC; Package / Case: 0603 (1608 Metric); Size / Dimension: 0.063" L x 0.031" W (1.60mm x 0.80mm); Height - Seated (Max): -; Thickness (Max): 0.035" (0.90mm); Lead Spacing: -; Lead Style: -; ComponentLink1URL: http://www.murata.com/~/media/webrenewal/support/library/catalog/products/capacitor/mlcc/c02e.pdf; ComponentLink1Description: http://www.murata.com/~/media/webrenewal/support/library/catalog/products/capacitor/mlcc/c02e.pdf; Supplier Part Number 1: 490-1529-6-ND
C15 C16 = C68nF: as C9 on sheet high_filter; Supplier 1: Digi-Key; RoHS: RoHS Compliant; Category: Capacitors; Stock 1: 117781; Pricing 1: 1=0.1, 10=0.056, 50=0.0306, 100=0.0259, 250=0.02116, 500=0.0181, 1000=0.0141 (USD); Packaging: Digi-Reel®; Part Status: Active; Operating Temperature: -55°C ~ 125°C; Features: -; Ratings: -; Applications: General Purpose; Mounting Type: Surface Mount, MLCC; Package / Case: 0603 (1608 Metric); Size / Dimension: 0.063" L x 0.031" W (1.60mm x 0.80mm); Height - Seated (Max): -; Thickness (Max): 0.035" (0.90mm); Lead Spacing: -; Lead Style: -; ComponentLink1URL: http://www.murata.com/~/media/webrenewal/support/library/catalog/products/capacitor/mlcc/c02e.pdf; ComponentLink1Description: http://www.murata.com/~/media/webrenewal/support/library/catalog/products/capacitor/mlcc/c02e.pdf; Supplier Part Number 1: 490-1523-6-ND
R19 R22 = R2_2k: as R41 on sheet top; Supplier 1: Digi-Key; RoHS: RoHS Compliant; Category: Resistors; Stock 1: 4524664; Pricing 1: 1=0.1, 10=0.013, 25=0.0092, 50=0.007, 100=0.0052, 250=0.00396, 500=0.00316, 1000=0.00233 (USD); Packaging: Digi-Reel®; Part Status: Active; Resistance (Ohms): 2.2k; Composition: Thick Film; Features: Moisture Resistant; Operating Temperature: -55°C ~ 155°C; Package / Case: 0603 (1608 Metric); Supplier Device Package: 0603; Size / Dimension: 0.063" L x 0.031" W (1.60mm x 0.80mm); Height - Seated (Max): 0.022" (0.55mm); Number of Terminations: 2; Failure Rate: -; ComponentLink1URL: http://www.yageo.com/NewPortal/yageodocoutput?fileName=/pdf/R-Chip/PYu-RC_Group_51_RoHS_L_4.pdf; ComponentLink1Description: http://www.yageo.com/NewPortal/yageodocoutput?fileName=/pdf/R-Chip/PYu-RC_Group_51_RoHS_L_4.pdf; Supplier Part Number 1: 311-2.20KHRDKR-ND
R20 R24 = R150: as R14 on sheet high_filter; Supplier 1: Digi-Key; RoHS: RoHS Compliant; Category: Resistors; Stock 1: 875380; Pricing 1: 1=0.1, 10=0.013, 25=0.0092, 50=0.007, 100=0.0052, 250=0.00396, 500=0.00316, 1000=0.00233 (USD); Packaging: Digi-Reel®; Part Status: Active; Composition: Thick Film; Features: Moisture Resistant; Operating Temperature: -55°C ~ 155°C; Package / Case: 0603 (1608 Metric); Supplier Device Package: 0603; Size / Dimension: 0.063" L x 0.031" W (1.60mm x 0.80mm); Height - Seated (Max): 0.022" (0.55mm); Number of Terminations: 2; Failure Rate: -; ComponentLink1URL: http://www.yageo.com/NewPortal/yageodocoutput?fileName=/pdf/R-Chip/PYu-RC_Group_51_RoHS_L_4.pdf; ComponentLink1Description: http://www.yageo.com/NewPortal/yageodocoutput?fileName=/pdf/R-Chip/PYu-RC_Group_51_RoHS_L_4.pdf; Supplier Part Number 1: 311-150HRDKR-ND
R21 R23 = R6_8k: as R3 on sheet low_filter; Supplier 1: Digi-Key; RoHS: RoHS Compliant; Category: Resistors; Stock 1: 100612; Pricing 1: 1=0.1, 10=0.019, 25=0.0136, 50=0.0104, 100=0.0077, 250=0.00584, 500=0.00468, 1000=0.00345 (USD); Packaging: Cut Tape (CT); Part Status: Active; Resistance (Ohms): 6.8k; Composition: Thick Film; Features: Automotive AEC-Q200; Operating Temperature: -55°C ~ 155°C; Package / Case: 0603 (1608 Metric); Supplier Device Package: 0603; Size / Dimension: 0.063" L x 0.031" W (1.60mm x 0.80mm); Height - Seated (Max): 0.022" (0.55mm); Number of Terminations: 2; Failure Rate: -; ComponentLink1URL: https://industrial.panasonic.com/cdbs/www-data/pdf/RDA0000/AOA0000C283.pdf; ComponentLink1Description: https://industrial.panasonic.com/cdbs/www-data/pdf/RDA0000/AOA0000C283.pdf; Supplier Part Number 1: P6.80KHCT-ND
U4 = LM833DT: as U1 on sheet low_filter; Supplier 1: Digi-Key; Manufacturer Part Number: LM833DT; RoHS: RoHS Compliant; Category: Integrated Circuits (ICs); Stock 1: 35363; Pricing 1: 1=0.45, 10=0.382, 100=0.2855, 500=0.22434, 1000=0.17335 (USD); Packaging: Cut Tape (CT); Part Status: Active; Amplifier Type: Audio; Output Type: -; -3db Bandwidth: -; Current - Output / Channel: -; Operating Temperature: -40°C ~ 105°C; Mounting Type: Surface Mount; Package / Case: 8-SOIC (0.154", 3.90mm Width); Supplier Device Package: 8-SO; ComponentLink1URL: http://www.st.com/content/ccc/resource/technical/document/datasheet/3b/52/12/a5/70/7c/44/0a/CD00000470.pdf/files/CD00000470.pdf/jcr:content/translations/en.CD00000470.pdf; ComponentLink1Description: http://www.st.com/content/ccc/resource/technical/document/datasheet/3b/52/12/a5/70/7c/44/0a/CD00000470.pdf/files/CD00000470.pdf/jcr:content/translations/en.CD00000470.pdf; Supplier Part Number 1: 497-1597-1-ND

## Sheet voltage_inverter.SchDoc
size A
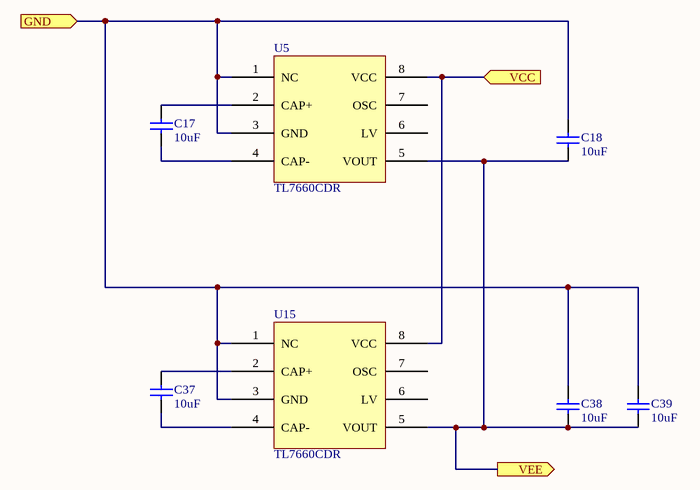
[diagram p5: voltage_inverter.SchDoc]

### Parts
C17  10uF  [C0603]
C18  10uF  [C0603]
C37  10uF  [C0603]
C38  10uF  [C0603]
C39  10uF  [C0603]
U5  TL7660CDR  [soic8]
U15  TL7660CDR  [soic8]

### Ports
GND (in), VCC (in), VEE (out)

### Nets
GND: C18.2 C38.2 C39.2 U5.1(NC) U5.3(GND) U15.1(NC) U15.3(GND) ; port GND
VCC: U5.8(VCC) U15.8(VCC) ; port VCC
NetC17_1: C17.1 U5.4(CAP-)
NetC17_2: C17.2 U5.2(CAP+)
NetC18_1: C18.1 C38.1 C39.1 U5.5(VOUT) U15.5(VOUT) ; port VEE
NetC37_1: C37.1 U15.4(CAP-)
NetC37_2: C37.2 U15.2(CAP+)

Not connected (* = marked no-connect by the designer): U5 6(LV) 7(OSC); U15 6(LV) 7(OSC)

### Library data of the parts
C17 C18 C37-C39 = C10uF: as C35 on sheet top; Supplier 1: Digi-Key; RoHS: RoHS Compliant; Category: Capacitors; Stock 1: 18386; Pricing 1: 1=0.27, 10=0.186, 25=0.1488, 50=0.124, 100=0.1054, 250=0.08368, 500=0.0744, 1000=0.06509 (USD); Packaging: Digi-Reel®; Part Status: Active; Operating Temperature: -55°C ~ 85°C; Features: -; Ratings: -; Applications: General Purpose; Mounting Type: Surface Mount, MLCC; Package / Case: 0603 (1608 Metric); Size / Dimension: 0.063" L x 0.031" W (1.60mm x 0.80mm); Height - Seated (Max): -; Thickness (Max): 0.035" (0.90mm); Lead Spacing: -; Lead Style: -; ComponentLink1URL: http://www.yageo.com/documents/recent/UPY-GPHC_X5R_4V-to-50V_23.pdf; ComponentLink1Description: http://www.yageo.com/documents/recent/UPY-GPHC_X5R_4V-to-50V_23.pdf; Failure Rate: -; Supplier Part Number 1: 311-1781-6-ND
U5 U15 = TL7660CDR: IC Switched Cap Voltage Inverter; Manufacturer: Texas Instruments; Function: Ratiometric; Output Configuration: Positive or Negative; Topology: Charge Pump; Output Type: Fixed; Number of Outputs: 1; Voltage - Input (Min): 1.5V; Voltage - Input (Max): 10V; Voltage - Output (Min/Fixed): -Vin, 2Vin; Frequency - Switching: 10kHz; Synchronous Rectifier: No; Supplier 1: Digi-Key; Manufacturer Part Number: TL7660CDR; RoHS: RoHS Compliant; Category: Integrated Circuits (ICs); Stock 1: 1431; Pricing 1: 1=1.36, 10=1.216, 100=0.948, 500=0.784, 1000=0.62 (USD); Packaging: Cut Tape (CT); Part Status: Active; Voltage - Output (Max): -; Current - Output: -; Operating Temperature: -40°C ~ 85°C (TA); Mounting Type: Surface Mount; Package / Case: 8-SOIC (0.154", 3.90mm Width); Supplier Device Package: 8-SOIC; ComponentLink1URL: http://www.ti.com/lit/ds/symlink/tl7660.pdf; ComponentLink1Description: http://www.ti.com/lit/ds/symlink/tl7660.pdf; Supplier Part Number 1: 296-21856-1-ND